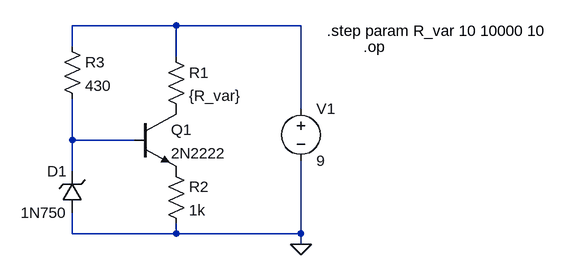
[diagram p0: schematic P2.asc]
P2.asc, the LTspice schematic file:
Version 4
SHEET 1 1048 680
WIRE 464 128 304 128
WIRE 656 128 464 128
WIRE 304 160 304 128
WIRE 464 176 464 128
WIRE 656 256 656 128
WIRE 304 304 304 240
WIRE 400 304 304 304
WIRE 304 352 304 304
WIRE 304 448 304 416
WIRE 464 448 464 432
WIRE 464 448 304 448
WIRE 656 448 656 336
WIRE 656 448 464 448
WIRE 656 464 656 448
FLAG 656 464 0
SYMBOL voltage 656 240 R0
SYMATTR InstName V1
SYMATTR Value 9
SYMBOL res 448 160 R0
SYMATTR InstName R1
SYMATTR Value {R_var}
SYMBOL res 448 336 R0
SYMATTR InstName R2
SYMATTR Value 1k
SYMBOL res 288 144 R0
SYMATTR InstName R3
SYMATTR Value 430
SYMBOL npn 400 256 R0
SYMATTR InstName Q1
SYMATTR Value 2N2222
SYMBOL zener 320 416 R180
WINDOW 0 24 64 Left 2
WINDOW 3 24 0 Left 2
SYMATTR InstName D1
SYMATTR Value 1N750
TEXT 752 160 Left 2 !.op
TEXT 696 136 Left 2 !.step param R_var 10 10000 10

The netlist it stands for:
* P2.asc
V1 N001 0 9
R1 N001 P001 {R_var}
R2 P002 0 1k
R3 N001 N002 430
Q1 P001 N002 P002 0 2N2222
D1 0 N002 1N750
.model D D
.lib standard.dio
.model NPN NPN
.model PNP PNP
.lib standard.bjt
.op
.step param R_var 10 10000 10
.backanno
.end